# EasyEDA Pro project ProPrj_Amy_From_SF.epro

# Schematic Schematic1
Board Name: Board1; Create Date: 2026-03-18; Page Name: P1; Project Name: Amy_From_SF; Schematic Name: Schematic1; Update Date: 2026-03-18; Company: EasyEDA.com; Page Size: A4; Version: V1.0
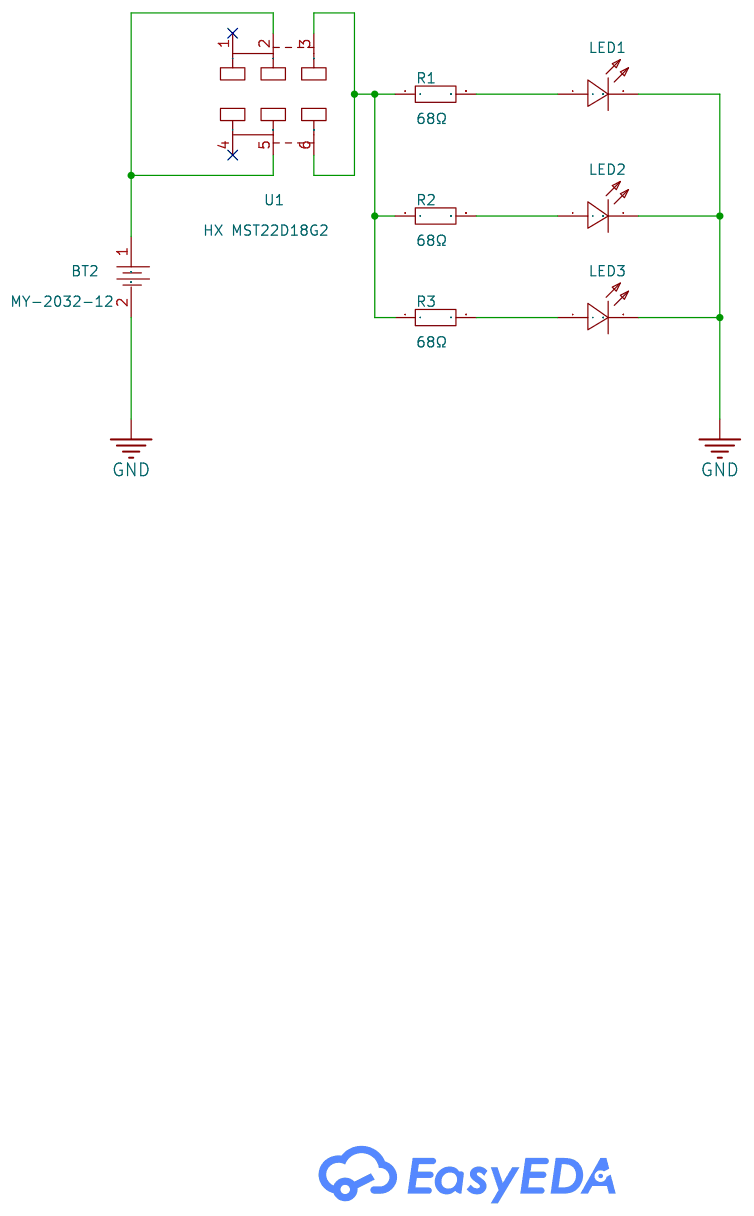
[diagram p0: schematic sheet]

## Parts
BT2  MY-2032-12  [BAT-SMD_MY-2032-12]
LED1  TJ-L5FYTGCRTFCSFLC2R-A5  [LED-TH_BD5.8-P2.54-FD]  (no BOM)
LED2  TJ-L5FYTGCRTFCSFLC2R-A5  [LED-TH_BD5.8-P2.54-FD]  (no BOM)
LED3  TJ-L5FYTGCRTFCSFLC2R-A5  [LED-TH_BD5.8-P2.54-FD]  (no BOM)
R1  68Ω  [R0805]
R2  68Ω  [R0805]
R3  68Ω  [R0805]
U1  HX MST22D18G2  [SW-SMD_MST22D18G2]

## Library data of the parts
BT2 = MY-2032-12: Type:Battery buckle Operating Temperature:-25~85℃ Contact material:Phosphor bronze Contact coating:Nickel plated Applicable battery specifications:CR2032; LCSC Part Name: MYOUNG(美阳)电池扣CR2032-P28 24.1MM 卧式SMT回流焊工艺标准 T=0.25 适配CR/LIR/ML2032电池; Supplier Part: C964833; Manufacturer: MYOUNG(美阳); JLCPCB Part Class: Extended Part; Datasheet: https://item.szlcsc.com/datasheet/MY-2032-12/1049799.html; Supplier: LCSC; Type: Battery buckle; Operating Temperature: -25~85℃; Contact material: Phosphor bronze; Contact coating: Nickel plated; Applicable battery specifications: CR2032
LED1-LED3 = TJ-L5FYTGCRTFCSFLC2R-A5: Lamp Holder Type:5mm round lamp head Illumination Color:Red Voltage - Forward(Vf):1.8V~2.6V Voltage - Forward(Vf):1.8V~2.6V Power(Watts):72mW Forward Current:20mA Wavelength - Dominant:620nm~630nm Wavelength - Dominant:620nm~630nm Peak Wavelength:630nm Di; LCSC Part Name: 红灯; Supplier Part: C331032; Manufacturer: TOGIALED(统佳); Supplier Footprint: 插件,D=5mm; JLCPCB Part Class: Extended Part; Datasheet: https://item.szlcsc.com/datasheet/TJ-L5FYTGCRTFCSFLC2R-A5/310401.html; Supplier: LCSC; Lamp Holder Type: 5mm round lamp head; Illumination Color: Red; Voltage - Forward(Vf): 1.8V~2.6V; Power(Watts): 72mW; Forward Current: 20mA; Wavelength - Dominant: 620nm~630nm; Peak Wavelength: 630nm; Lens Color: Water Clear; Luminous Intensity: 5cd; Viewing Angle: 30°; Operating Temperature: -20℃~+80℃
R1-R3 = 0805W8F680JT5E: Type:Thick Film Resistor Resistance:68Ω Tolerance:±1% Tolerance:±1% Power(Watts):125mW Voltage-Supply(Max):150V Temperature Coefficient:±200ppm/℃ Temperature Coefficient:±200ppm/℃ Operating Temperature:-55℃~+155℃ Operating Temperature:-55℃~+155℃; LCSC Part Name: 68Ω ±1% 125mW 厚膜电阻; Supplier Part: C17802; Manufacturer: UNI-ROYAL(厚声); Supplier Footprint: 0805; JLCPCB Part Class: Extended Part; Datasheet: https://item.szlcsc.com/datasheet/0805W8F680JT5E/18490.html; Supplier: LCSC; Type: Thick Film Resistor; Tolerance: ±1%; Power(Watts): 125mW; Voltage-Supply(Max): 150V; Temperature Coefficient: ±200ppm/℃; Operating Temperature: -55℃~+155℃
U1 = HX MST22D18G2: Circuit:DPDT Actuator Style:Rectangular Columnar Termination Style:SMD(SMT) Tab Length:9.1mm Width:3.5mm Switch Height:5.5mm Mounting Type:Surface Mount,Vertical Actuator Color:Black Current Rating:100mA Voltage Rating:12V Life:10,000 Cycles Operating Tem; LCSC Part Name: 拨动开关/两档立式 6脚贴片 柄长2.0mm 大六立贴 9.1*3.6mm; Supplier Part: C5149822; Manufacturer: hanxia(韩下); Supplier Footprint: SMD,9.1x3.5mm; JLCPCB Part Class: Extended Part; Datasheet: https://item.szlcsc.com/datasheet/HX%2520MST22D18G2/5774336.html; Supplier: LCSC; Circuit: DPDT; Actuator Style: Rectangular Columnar; Termination Style: SMD(SMT) Tab; Length: 9.1mm; Width: 3.5mm; Switch Height: 5.5mm; Mounting Type: Surface Mount,Vertical; Actuator Color: Black; Current Rating: 100mA; Voltage Rating: 12V; Life: 10,000 Cycles; Operating Temperature: -25℃~+70℃

## Nets
GND: BT2.2 LED1.2(C) LED2.2(C) LED3.2(C)
$1N854: LED1.1(A) R1.2
$1N859: LED2.1(A) R2.2
$1N864: LED3.1(A) R3.2
$1N1128: BT2.1 U1.2 U1.5
$1N1151: R1.1 R2.1 R3.1 U1.3 U1.6

Not connected (* = marked no-connect by the designer): U1 1* 4*

# Board PCB1
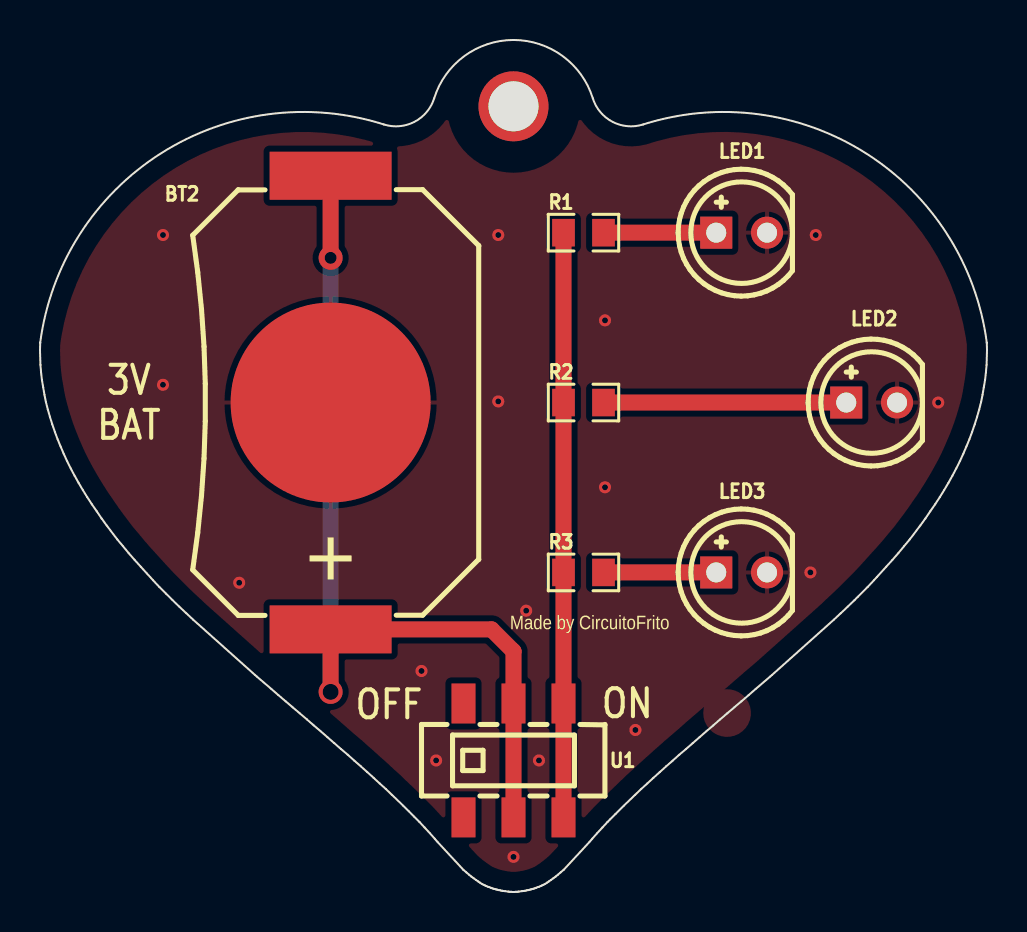
[diagram p1: board, top side]
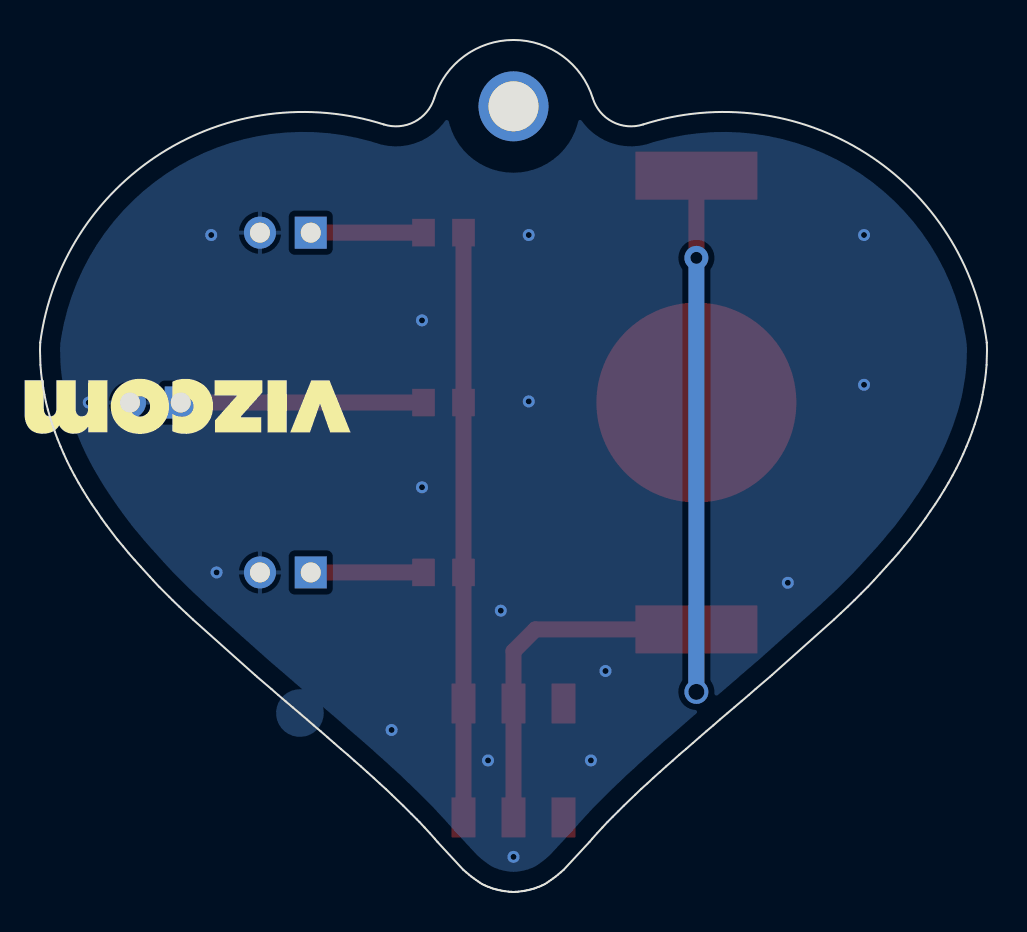
[diagram p2: board, bottom side, seen from below]

Outline 47.35 x 42.63 mm; copper layers: Top Layer, Bottom Layer. Coordinates in mm from the lower left corner of the outline.
Outline path: 0,27.11 0.02,26.37 0.05,26 0.1,25.63 0.16,25.25 0.22,24.88 0.3,24.51 0.39,24.14 0.5,23.77 0.61,23.4 0.74,23.03 0.88,22.66 1.03,22.3 1.19,21.93 1.35,21.56 1.53,21.2 1.72,20.84 1.93,20.48 2.14,20.12 2.36,19.76 2.59,19.4 2.84,19.05 3.08,18.69 3.33,18.34 3.86,17.64 4.15,17.3 4.43,16.95 4.73,16.62 5.04,16.28 5.34,15.94 5.65,15.6 5.97,15.26 6.3,14.93 6.63,14.61 6.96,14.28 7.31,13.95 7.65,13.63 10.75,10.86 10.85,10.77 11.57,10.16 11.92,9.85 12.28,9.55 12.64,9.24 12.99,8.94 13.35,8.64 13.68,8.34 14.03,8.04 14.37,7.75 14.71,7.45 15.05,7.15 15.39,6.87 15.72,6.57 16.04,6.29 16.36,6 16.68,5.72 16.99,5.43 17.29,5.15 17.59,4.87 18.16,4.32 18.44,4.04 18.71,3.77 18.98,3.5 19.23,3.23 19.49,2.94 19.74,2.67 19.87,2.51 21.17,1.11 21.31,0.98 21.45,0.87 21.57,0.77 21.69,0.69 21.8,0.6 21.91,0.53 22,0.47 22.1,0.4 22.18,0.36 22.26,0.33 22.32,0.3 22.39,0.26 22.47,0.24 22.54,0.21 22.63,0.18 22.7,0.16 22.79,0.14 22.86,0.12 22.94,0.1 23.02,0.08 23.1,0.06 23.25,0.04 23.42,0.02 23.49,0.01 23.58,0.01 23.65,0 arc(23.67,0) 23.7,0 23.77,0.01 23.85,0.01 23.93,0.02 24.1,0.04 24.25,0.06 24.33,0.08 24.41,0.1 24.49,0.12 24.56,0.14 24.65,0.16 24.72,0.18 24.81,0.21 24.88,0.24 24.96,0.26 25.03,0.3 25.09,0.33 25.17,0.36 25.25,0.4 25.35,0.47 25.44,0.53 25.55,0.6 25.66,0.69 25.78,0.77 25.9,0.87 26.03,0.98 26.18,1.11 27.48,2.51 27.61,2.67 27.86,2.94 28.12,3.23 28.37,3.5 29.19,4.32 29.76,4.87 30.06,5.15 30.36,5.43 30.67,5.72 30.99,6 31.31,6.29 31.63,6.57 31.96,6.87 32.3,7.15 32.64,7.45 32.98,7.75 33.32,8.04 33.67,8.34 34,8.64 34.36,8.94 34.71,9.24 35.07,9.55 35.43,9.85 35.78,10.16 36.5,10.77 36.6,10.86 39.7,13.63 40.04,13.95 40.39,14.28 40.72,14.61 41.38,15.26 41.7,15.6 42.31,16.28 42.62,16.62 42.92,16.95 43.2,17.3 43.49,17.64 44.02,18.34 44.27,18.69 44.51,19.05 44.76,19.4 44.99,19.76 45.21,20.12 45.42,20.48 45.62,20.84 45.82,21.2 46,21.56 46.16,21.93 46.32,22.3 46.47,22.66 46.61,23.03 46.74,23.4 46.85,23.77 46.96,24.14 47.05,24.51 47.13,24.88 47.19,25.25 47.25,25.63 47.3,26 47.33,26.37 47.35,27.11 47.34,27.49 arc(41.3,36.96) 30.16,38.4 arc(28.63,38.54) 27.64,39.72 arc(23.67,42.63) 19.71,39.72 arc(18.72,38.54) 17.19,38.4 arc(6.05,36.96) 0.01,27.49 0,27.11
Stack: Top Layer 0.035mm / Dielectric1 1.51mm FR4 er 4.5 / Bottom Layer 0.035mm

## Design rules (mm)
template: Custom Config
spacing copperThickness1oz (default): track to track 0.102, other pairs 0.152 to 0.3
spacing copperThickness2oz: track to track 0.203, other pairs 0.152 to 0.3
track width copperThickness1oz (default): min 0.127, default 0.254, max 2.54
track width copperThickness2oz: min 0.203, default 0.254, max 2.54
differential pair differentialPair (default): width min 0.127, default 0.254, max 2.54; gap min 0.152, default 0.152
via viaSize (default): diameter min 0.5, default 0.61, max 10; hole min 0.3, default 0.305, max 6.3
pour e144 uses CM1
pour e179 uses CM1

## Placement (name value [footprint] x y rotation side)
BT2  MY-2032-12  [BAT-SMD_MY-2032-12]  14.53 24.49 270 top
LED1  TJ-L5FYTGCRTFCSFLC2R-A5  [LED-TH_BD5.8-P2.54-FD]  35.08 32.99 0 top
LED2  TJ-L5FYTGCRTFCSFLC2R-A5  [LED-TH_BD5.8-P2.54-FD]  41.58 24.49 0 top
LED3  TJ-L5FYTGCRTFCSFLC2R-A5  [LED-TH_BD5.8-P2.54-FD]  35.08 15.99 0 top
NOREF  -  [Pad_e70]  23.67 39.31 0 top
R1  68Ω  [R0805]  27.17 32.99 0 top
R2  68Ω  [R0805]  27.17 24.49 0 top
R3  68Ω  [R0805]  27.17 15.99 0 top
U1  HX MST22D18G2  [SW-SMD_MST22D18G2]  23.67 6.58 0 top

## Footprints (pads in the part's own frame, mm; a bottom-side part is the same pattern mirrored in y, then rotated)
BAT-SMD_MY-2032-12
  rect 2.4x6.1 smd: 1(-11.35,0) 1(11.35,0)
  round 10 smd: 2(0,0)
LED-TH_BD5.8-P2.54-FD
  rect 1.6x1.6 hole 1: 1(-1.27,0)
  round 1.6 hole 1: 2(1.27,0)
Pad_e70
  round 3.5 hole 2.5: 1(0,0)
R0805
  rect 1.133x1.377 smd: 1(-1,0) 2(1,0)
SW-SMD_MST22D18G2
  rect 1.2x2 smd: 1(-2.5,2.85) 2(0,2.85) 3(2.5,2.85) 4(-2.5,-2.85) 5(0,-2.85) 6(2.5,-2.85)

## Nets
As in the schematic.

Pads without a net: NOREF 1; U1 1 4

## Via types
v1: diameter 1.2, hole 0.8, Top Layer to Bottom Layer, 1 via
v2: diameter 1.2, hole 0.6, Top Layer to Bottom Layer, 1 via
v3: diameter 0.6, hole 0.3, Top Layer to Bottom Layer, 16 vias

## Routing (per net, layer and track width the routed paths; a pad name or vN(x,y) marks a point on that pad's centre or on a via; arc(x,y) is an arc through that point)
GND:
  vias: v3(6.15,32.87) v3(6.15,25.38) v3(9.96,15.47) v3(19.07,11.06) v3(19.81,6.58) v3(22.91,32.87) v3(22.91,24.55) v3(23.67,1.76) v3(24.31,14.08) v3(24.95,6.58) v3(28.25,28.6) v3(28.25,20.25) v3(29.77,8.11) v3(38.52,15.99) v3(38.79,32.87) v3(44.91,24.49)
$1N854: length 5.6
  Top Layer w0.8: R1.2 LED1.1
$1N859: length 12.1
  Top Layer w0.8: R2.2 LED2.1
$1N864: length 5.6
  Top Layer w0.8: R3.2 LED3.1
$1N1128: length 46.9
  Top Layer w0.8: v1(14.53,10.01) BT2.1 22.58,13.14 23.67,12.05 U1.2 U1.5 ; 14.53,35.84 v2(14.53,31.73)
  Bottom Layer w0.8: v2(14.53,31.73) v1(14.53,10.01)
$1N1151: length 29.3
  Top Layer w0.8: R1.1 R2.1 R3.1 U1.3 U1.6

## Copper pours and planes (outline as drawn; the poured copper is in the pictures)
GND on Top Layer: -8.46,46.84 57.84,46.84 57.84,-2.18 -8.46,-2.18
GND on Bottom Layer: -9.09,46.72 57.2,46.72 57.2,-2.31 -9.09,-2.31

## Text on the board
Top Silkscreen Layer: 3V / BAT | OFF | ON | Made by CircuitoFrito
